# EAGLE design controller_pi (EAGLE 7.2.0)
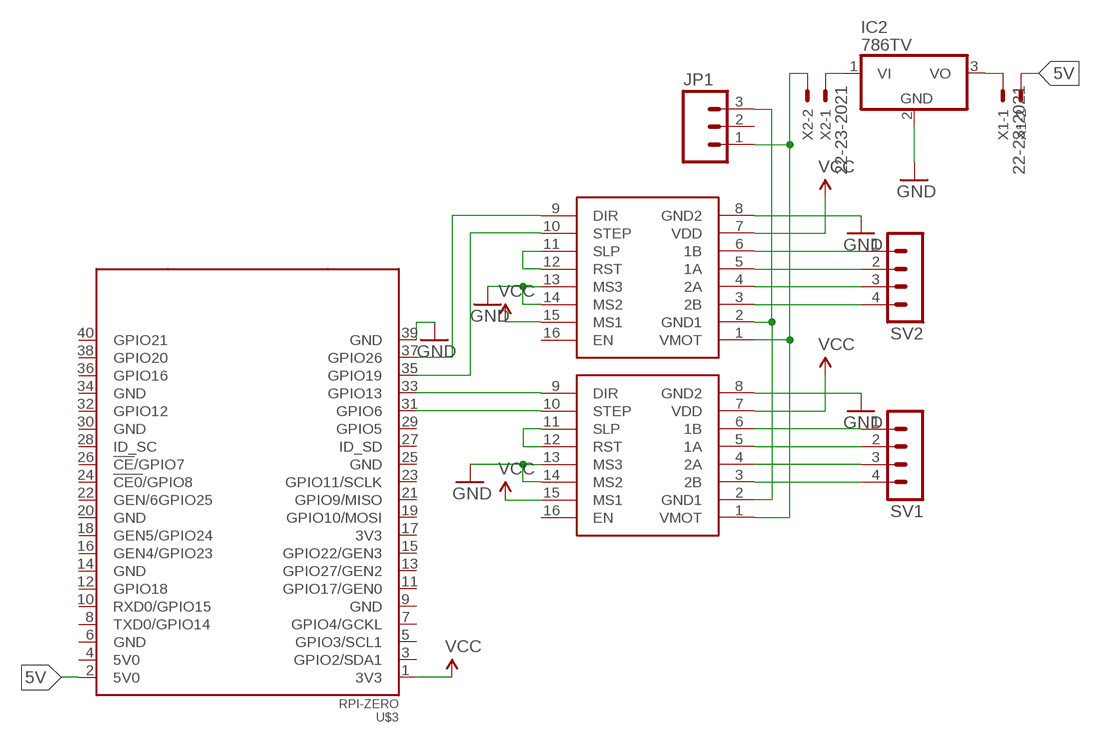
[diagram p0: schematic, sheet 1]

## Parts
IC2  786TV  [TO220V]
JP1  M03SCREW  [SCREWTERMINAL-3.5MM-3]
SV1  MA04-1  [MA04-1]
SV2  MA04-1  [MA04-1]
U$1  POLOLUESTEPPERDRIVER  [DIL16]
U$2  POLOLUESTEPPERDRIVER  [DIL16]
U$3  RPI-ZERO  [RASPBERRYPI_BASTELSTUBE_V13_RASPI_BOARD_B+_FULL]
X1  22-23-2021  [22-23-2021]
X2  22-23-2021  [22-23-2021]

## Nets
5V: U$3.2(5V0) X1.2
GND: IC2.2(GND) U$1.8(GND2) U$1.13(MS3) U$1.14(MS2) U$2.8(GND2) U$2.13(MS3) U$2.14(MS2) U$3.39(GND)
N$1: SV2.1 U$2.6(1B)
N$2: SV2.2 U$2.5(1A)
N$3: SV2.3 U$2.4(2A)
N$4: SV2.4 U$2.3(2B)
N$5: U$2.10(STEP) U$3.35(GPIO19)
N$6: U$2.9(DIR) U$3.37(GPIO26)
N$7: U$2.11(SLP) U$2.12(RST)
N$8: U$1.11(SLP) U$1.12(RST)
N$9: SV1.1 U$1.6(1B)
N$10: SV1.2 U$1.5(1A)
N$11: SV1.3 U$1.4(2A)
N$12: SV1.4 U$1.3(2B)
N$13: U$1.9(DIR) U$3.33(GPIO13)
N$14: U$1.10(STEP) U$3.31(GPIO6)
N$17: JP1.3 U$1.2(GND1) U$2.2(GND1)
N$18: JP1.1 U$1.1(VMOT) U$2.1(VMOT) X2.2
N$19: IC2.3(VO) X1.1
N$20: IC2.1(VI) X2.1
VCC: U$1.7(VDD) U$1.15(MS1) U$2.7(VDD) U$2.15(MS1) U$3.1(3V3)
Unconnected: JP1.2 U$1.16(EN) U$2.16(EN) U$3.3(GPIO2/SDA1) U$3.4(5V0) U$3.5(GPIO3/SCL1) U$3.6(GND) U$3.7(GPIO4/GCKL) U$3.8(TXD0/GPIO14) U$3.9(GND) U$3.10(RXD0/GPIO15) U$3.11(GPIO17/GEN0) U$3.12(GPIO18) U$3.13(GPIO27/GEN2) U$3.14(GND) U$3.15(GPIO22/GEN3) U$3.16(GEN4/GPIO23) U$3.17(3V3) U$3.18(GEN5/GPIO24) U$3.19(GPIO10/MOSI) U$3.20(GND) U$3.21(GPIO9/MISO) U$3.22(GEN/6GPIO25) U$3.23(GPIO11/SCLK) U$3.24(!CE0!/GPIO8) U$3.25(GND) U$3.26(!CE!/GPIO7) U$3.27(ID_SD) U$3.28(ID_SC) U$3.29(GPIO5) U$3.30(GND) U$3.32(GPIO12) U$3.34(GND) U$3.36(GPIO16) U$3.38(GPIO20) U$3.40(GPIO21)

## Library data of the parts
IC2 = linear:78*: Positive VOLTAGE REGULATOR Source: http://cache.national.com/ds/LM/LM78L05.pdf http://www.fairchildsemi.com/ds/LM/LM7805.pdf
JP1 = SparkFun-Connectors:M03: Header 3 Standard 3-pin 0.1" header. Use with straight break away headers (SKU : PRT-00116), right angle break away headers (PRT-00553), swiss pins (PRT-00743), machine pins (PRT-00117), and female headers (PRT-00115). Molex polarized connector foot print use with SKU : PRT-08232 with associated crimp pins and housings.
SV1 SV2 = con-lstb:MA04-1: PIN HEADER; OC_FARNELL: unknown; OC_NEWARK: unknown
U$1 U$2 = reprap:POLOLUESTEPPERDRIVER: Pololu stepper driver based on the A4983.
U$3 = RPI-Zero:RPI-ZERO
X1 X2 = con-molex:22-23-2021: .100" (2.54mm) Center Header - 2 Pin; MF: MOLEX; MPN: 22-23-2021; OC_FARNELL: 1462926; OC_NEWARK: 25C3832

## Board
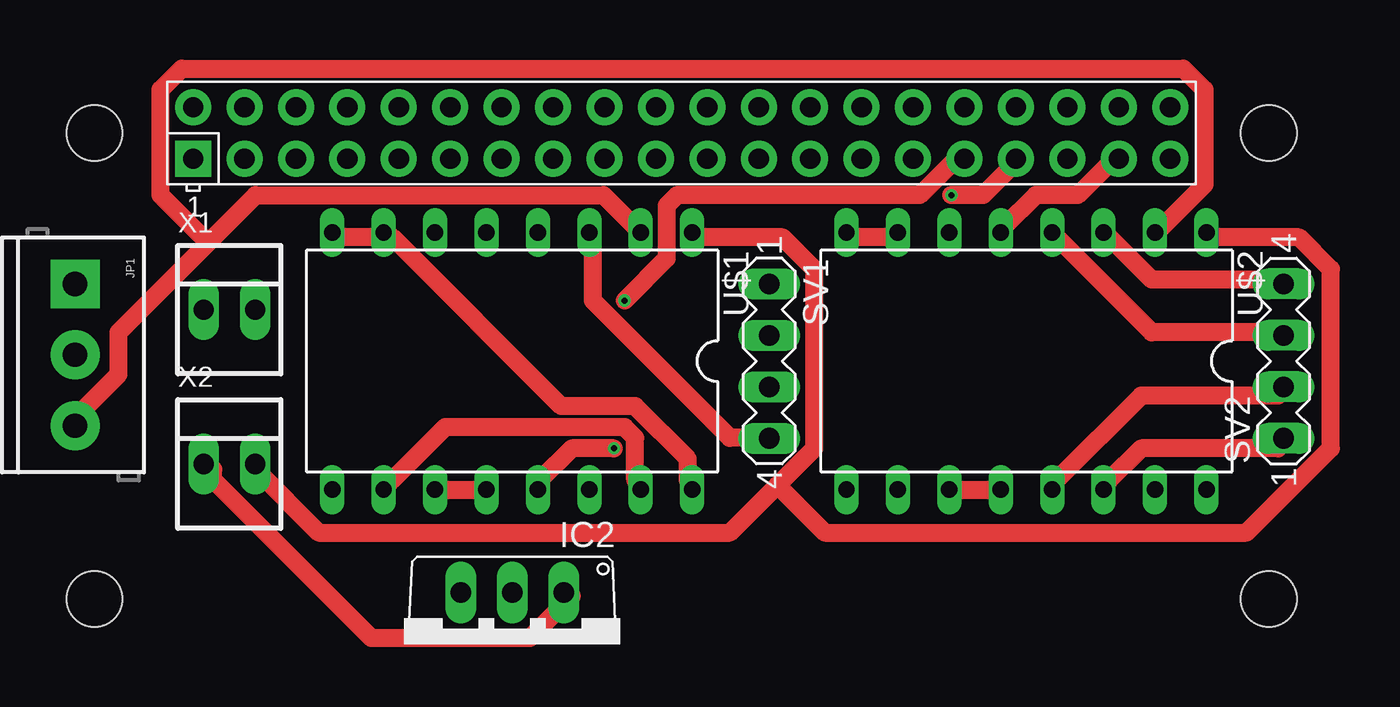
[diagram p1: board, top side]
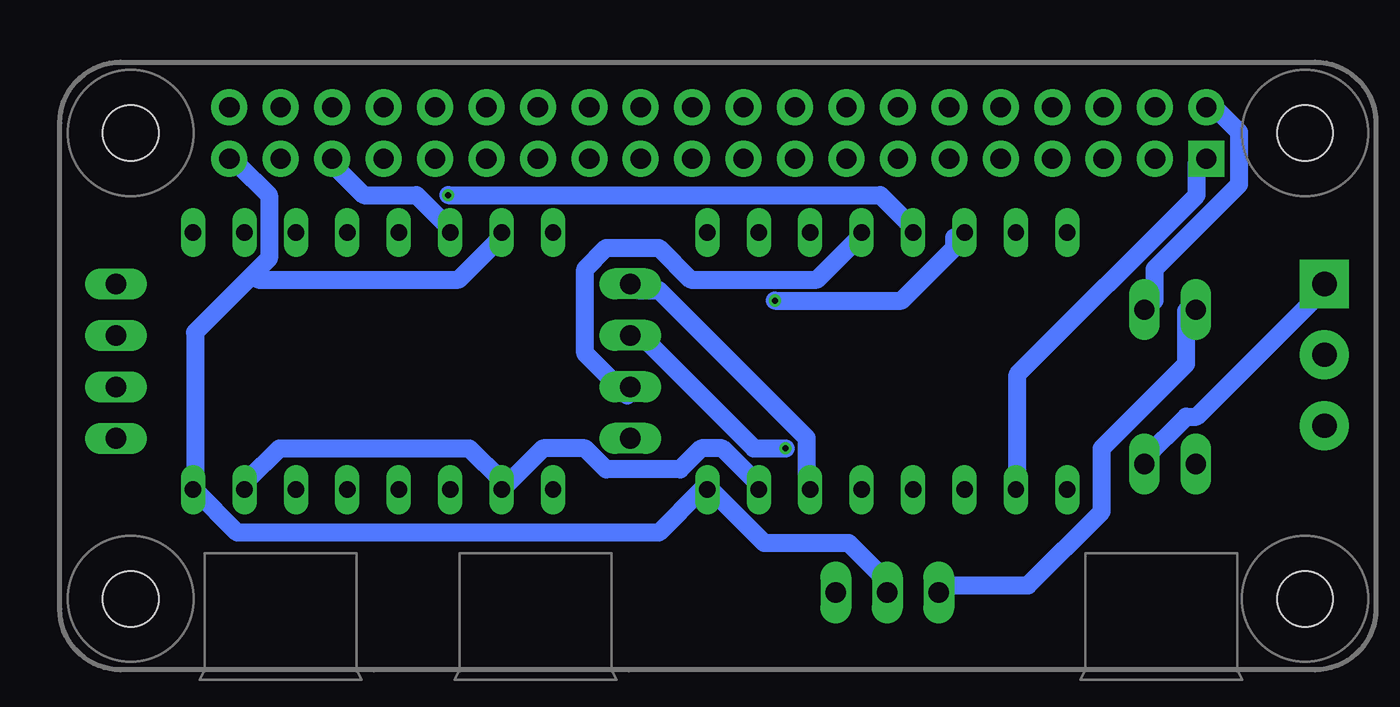
[diagram p2: board, bottom side, seen from below]

No outline drawn. Coordinates in mm, seen from the top.
Copper layers (1*2*15*16): Top 0.035mm / dielectric 0.2mm / layer 2 0.0175mm / dielectric 1.1mm / layer 15 0.0175mm / dielectric 0.2mm / Bottom 0.035mm
Design rules "SeeedStudio_DRU_no_angle_20130527 *": minimum track width 35mil, minimum drill 12mil, track to track 6mil, track to pad 6mil, pad to pad 6mil, via to via 6mil, smd to smd 0mil, copper to edge 10mil, drill to drill 10mil, minimum pad ring 6mil, minimum via ring 6mil, stop-mask expansion 2mil, vias tented up to drill 25mil, thermal gap 10mil

### Footprints (pad centres in the part's own frame; a part is rotated, then mirrored left to right if it is on the bottom)
TO220V = drill 1.016 long: 1 -2.54,-2.54; 2 0,-2.54; 3 2.54,-2.54
SCREWTERMINAL-3.5MM-3 = drill 1.2 pad 2.413 square: 1 0,0 | drill 1.2 pad 2.413: 2 3.5,0; 3 7,0
MA04-1 = drill 1.016 long: 1 -3.81,0; 2 -1.27,0; 3 1.27,0; 4 3.81,0
DIL16 = drill 0.813 long: 1 -17.78,8.89; 2 -17.78,6.35; 3 -17.78,3.81; 4 -17.78,1.27; 5 -5.08,1.27; 6 -5.08,3.81; 7 -5.08,6.35; 8 -5.08,8.89; 9 -17.78,-1.27; 10 -17.78,-3.81; 11 -5.08,-3.81; 12 -5.08,-1.27; 13 -17.78,-6.35; 14 -17.78,-8.89; 15 -5.08,-6.35; 16 -5.08,-8.89
RASPBERRYPI_BASTELSTUBE_V13_RASPI_BOARD_B+_FULL = drill 1 pad 1.778 square: 1 8.37,25.23 | drill 1 pad 1.778: 2 8.37,27.77; 3 10.91,25.23; 4 10.91,27.77; 5 13.45,25.23; 6 13.45,27.77; 7 15.99,25.23; 8 15.99,27.77; 9 18.53,25.23; 10 18.53,27.77; 11 21.07,25.23; 12 21.07,27.77; 13 23.61,25.23; 14 23.61,27.77; 15 26.15,25.23; 16 26.15,27.77; 17 28.69,25.23; 18 28.69,27.77; 19 31.23,25.23; 20 31.23,27.77; 21 33.77,25.23; 22 33.77,27.77; 23 36.31,25.23; 24 36.31,27.77; 25 38.85,25.23; 26 38.85,27.77; 27 41.39,25.23; 28 41.39,27.77; 29 43.93,25.23; 30 43.93,27.77; 31 46.47,25.23; 32 46.47,27.77; 33 49.01,25.23; 34 49.01,27.77; 35 51.55,25.23; 36 51.55,27.77; 37 54.09,25.23; 38 54.09,27.77; 39 56.63,25.23; 40 56.63,27.77 | hole 2.75: 3.5,3.5; 3.5,26.5; 61.5,3.5; 61.5,26.5
22-23-2021 = drill 1 long: 1 -1.27,0; 2 1.27,0

### Placement (x,y rotation side)
IC2  24.13,1.27 180 top
JP1  2.54,19.05 270 top
SV1  36.83,15.24 270 top
SV2  62.23,15.24 90 top
U$1  24.13,3.81 270 top
U$2  49.53,3.81 270 top
U$3  0,0 0 top
X1  10.16,17.78 0 top
X2  10.16,10.16 0 top

### Tracks (layer width: path | path; a pad name or v marks a point on that pad's centre or on a via)
5V
  Bottom 0.889: X1.2 10.94,18.22 10.94,19.79 6.77,23.95 6.77,26.56 8.33,28.12 U$3.2
GND
  Top 0.889: U$2.14 41.13,21.35 42.7,21.35 U$2.13 | U$1.14 15.62,21.35 17.7,21.35 U$1.13 18.22,21.35 26.56,13.02 30.2,13.02 32.8,10.41 32.8,9.37 U$1.8
  Bottom 0.889: 55.45,19.53 54.67,20.31 54.67,23.43 56.24,24.99 U$3.39 | 55.45,19.53 58.32,16.66 58.32,9.37 U$2.8 58.32,8.85 56.24,6.77 35.41,6.77 33.33,8.85 U$1.8 32.8,8.85 30.2,6.25 26.04,6.25 23.95,4.17 IC2.2 | U$2.13 43.22,21.35 45.3,19.27 55.19,19.27 55.45,19.53
N$1
  Top 0.889: U$2.6 53.63,9.37 55.19,10.94 61.96,10.94 SV2.1
N$2
  Top 0.889: U$2.5 51.03,9.37 55.19,13.54 61.96,13.54 SV2.2
N$3
  Top 0.889: U$2.4 51.03,21.35 55.72,16.66 61.96,16.66 SV2.3
N$4
  Top 0.889: U$2.3 53.63,21.35 55.72,19.27 61.96,19.27 SV2.4
N$5
  Bottom 0.889: U$2.10 45.82,21.87 47.38,23.43 49.99,23.43 51.55,24.99 U$3.35
N$6
  Top 0.889: U$2.9 48.42,21.87 49.99,23.43 52.07,23.43 53.63,24.99 U$3.37
N$7
  Top 0.889: U$2.11 45.82,8.85 47.9,8.85 U$2.12
N$8
  Top 0.889: U$1.11 20.83,8.85 22.39,8.85 U$1.12
N$9
  Bottom 0.889: U$1.6 28.12,9.37 28.12,11.46 35.41,18.75 36.45,18.75 SV1.1
N$10  (via drill 0.3)
  Top 0.889: v29.16,10.94 27.08,10.94 25.51,9.37 U$1.5
  Bottom 0.889: v29.16,10.94 30.72,10.94 36.45,16.66 SV1.2
N$11
  Bottom 0.889: U$1.4 25.51,21.35 27.6,19.27 33.85,19.27 35.41,20.83 38.01,20.83 39.05,19.79 39.05,15.62 36.97,13.54 SV1.3
N$12
  Top 0.889: U$1.3 28.12,21.35 28.12,18.22 34.89,11.46 36.45,11.46 SV1.4
N$13  (via drill 0.3)
  Top 0.889: v45.82,23.43 47.38,23.43 48.95,24.99 U$3.33
  Bottom 0.889: v45.82,23.43 24.47,23.43 22.91,21.87 U$1.9
N$14  (via drill 0.3)
  Top 0.889: v29.68,18.22 31.76,20.31 31.76,22.91 32.28,23.43 44.26,23.43 46.34,25.51 U$3.31
  Bottom 0.889: v29.68,18.22 23.43,18.22 20.83,20.83 20.83,21.35 U$1.10
N$17
  Top 0.889: U$1.2 28.64,23.43 11.46,23.43 9.11,21.09 | 9.11,21.09 4.69,16.66 4.69,14.58 2.6,12.5 JP1.3 | 9.11,21.09 6.77,23.43 6.77,28.64 7.81,29.68 57.28,29.68 58.32,28.64 58.32,23.95 56.24,21.87 U$2.2
N$18
  Top 0.889: 37.23,9.11 34.89,6.77 14.58,6.77 11.46,9.89 X2.2 | 37.23,9.11 39.05,10.94 39.05,19.79 37.49,21.35 33.33,21.35 U$1.1 | 37.23,9.11 39.57,6.77 60.4,6.77 64.57,10.94 64.57,19.79 63.01,21.35 58.84,21.35 U$2.1
  Bottom 0.889: JP1.1 2.6,18.75 8.85,12.5 9.37,12.5 11.46,10.41 X2.2
N$19
  Bottom 0.889: X1.1 9.37,17.7 9.37,15.1 13.54,10.94 13.54,7.81 17.18,4.17 21.35,4.17 IC2.3
N$20
  Top 0.889: X2.1 9.37,9.89 9.37,9.37 17.18,1.56 24.99,1.56 27.08,3.65 IC2.1
VCC
  Top 0.889: U$1.15 18.22,9.37 20.83,11.98 29.68,11.98 30.2,11.46 30.2,9.37 U$1.7
  Bottom 0.889: U$2.7 55.72,9.37 54.15,10.94 44.78,10.94 43.22,9.37 U$2.15 41.13,10.94 39.05,10.94 38.01,9.89 34.37,9.89 33.33,10.94 32.28,10.94 30.72,9.37 U$1.7 | U$3.1 8.85,24.99 8.85,23.43 17.7,14.58 17.7,9.37 U$1.15